# Altium schematic sheet IMU.SchDoc
size A; SheetNumber: 3; SheetTotal: 5
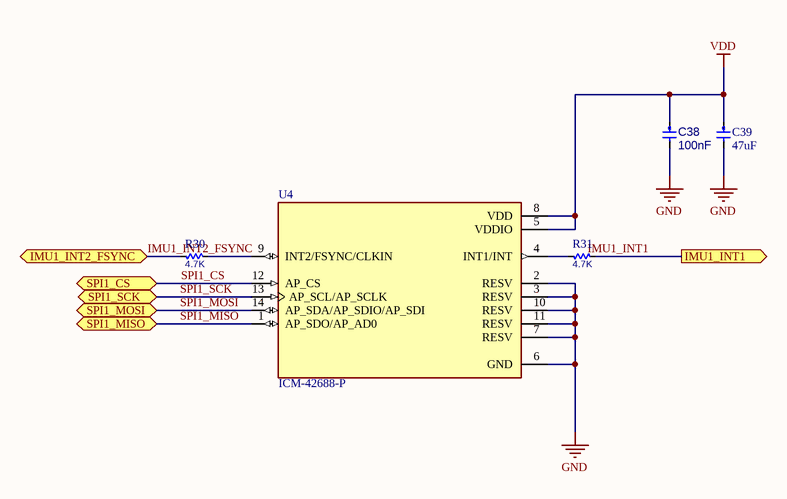
[diagram p0: IMU.SchDoc]

## Parts
C38  Capacitance: 100nF  [CAP0603]  (hidden comment: C0603C104M5RACTU)
C39  Capacitance: 47uF  [CAP0805]  (hidden comment: CL21A476MQYNNNE)
R30  value 4.7K  [RES0402]  (hidden comment: RES0402)
R31  value 4.7K  [RES0402]  (hidden comment: RES0402)
U4  ICM-42688-P  [ICM-42688-P]

## Ports
IMU1_INT1 (out), IMU1_INT2_FSYNC (bidir), SPI1_CS (bidir), SPI1_MISO (bidir), SPI1_MOSI (bidir), SPI1_SCK (bidir)

## Nets
GND: C38.2 C39.2 U4.2(RESV) U4.3(RESV) U4.6(GND) U4.7(RESV) U4.10(RESV) U4.11(RESV)
VDD: C38.1 C39.1 U4.5(VDDIO) U4.8(VDD)
IMU1_INT1: R31.2 ; port IMU1_INT1
IMU1_INT2_FSYNC: R30.1 ; port IMU1_INT2_FSYNC
SPI1_CS: U4.12(AP_CS) ; port SPI1_CS
SPI1_MISO: U4.1(AP_SDO/AP_AD0) ; port SPI1_MISO
SPI1_MOSI: U4.14(AP_SDA/AP_SDIO/AP_SDI) ; port SPI1_MOSI
SPI1_SCK: U4.13(AP_SCL/AP_SCLK) ; port SPI1_SCK
NetR30_2: R30.2 U4.9(INT2/FSYNC/CLKIN)
NetR31_1: R31.1 U4.4(INT1/INT)

## Notes on the sheet
- Labels drawn without touching a wire or pin: IMU1_INT1

## Library data of the parts
C38 = CMP-00691-1: CAP CER 0.1UF 50V X7R 0603; Manufacturer 1: KEMET; Tolerance: 20%; Dielectric Material: Ceramic; Dissipation Factor: 2.5%; Packaging: Tape and Reel; Mount: Surface Mount,PCB; Min Operating Temperature: -55°C; Case/Package: 0603; Max Operating Temperature: 125°C; Length: 1.6mm; Voltage Rating: 50V; Width: 0.031inch; Voltage Rating (DC): 50V; Dielectric: X7R; Thickness: 0.034inch; Case Code (Imperial): 0603; Case Code (Metric): 1608; Contact Plating: Tin,Matte; Depth: 0.8mm; Height: 0.8mm; Lead Pitch: 0.7mm; Manufacturer Part Number 1: C0603C104M5RACTU; Package Quantity: 1; Radiation Hardening: No; REACH SVHC: No SVHC; Termination: SMD/SMT
C39 = 885012107014: CAP CER 47UF 6.3V X5R 0805; Tolerance: 20%; Manufacturer Part Number: CL21A476MQYNNNE; RoHS: Yes; Category: Ceramic Capacitors; Stock 1: 3580; Pricing 1: 1=0.37000, 5=0.35200, 10=0.33000, 25=0.31900, 50=0.30900, 100=0.29800 (USD); Mount: Surface Mount; Case/Package: 0805; Case Code (Metric): 2012; Case Code (Imperial): 0805; Min Operating Temperature: -55°C; Max Operating Temperature: 85°C; Packaging: Cut Tape; Voltage Rating: 6.3V; Dielectric: X5R; Voltage Rating (DC): 6.3V; Series: WCAP-CSGP; Length: 0.079inch; Width: 0.049inch; Thickness: 0.057inch; RoHS Compliant: Yes; ComponentLink1URL: http://www.farnell.com/datasheets/1958454.pdf?src-supplier=Farnell; ComponentLink1Description: http://www.farnell.com/datasheets/1958454.pdf?src-supplier=Farnell; ComponentLink2URL: http://www.farnell.com/datasheets/1958454.pdf?src-supplier=Element14; ComponentLink2Description: http://www.farnell.com/datasheets/1958454.pdf?src-supplier=Element14; ComponentLink3URL: https://katalog.we-online.de/pbs/datasheet/885012107014.pdf?src-supplier=Digi-Key; ComponentLink3Description: https://katalog.we-online.de/pbs/datasheet/885012107014.pdf?src-supplier=Digi-Key; ComponentLink4URL: http://www.farnell.com/datasheets/1958454.pdf?src-supplier=Newark; ComponentLink4Description: http://www.farnell.com/datasheets/1958454.pdf?src-supplier=Newark; Supplier 1: Newark
R30 R31 = RES0402: RES 0402; MP: add later
U4 = ICM-42688-P: Accelerometer, Gyroscope, 6 Axis Sensor Output; Package: None; MP: ICM-42688-P; Value: *; Availability: Unavailable; Price: None